# EAGLE schematic PIC32DIP (EAGLE 5.07)
PROJECT: PIC32DIP
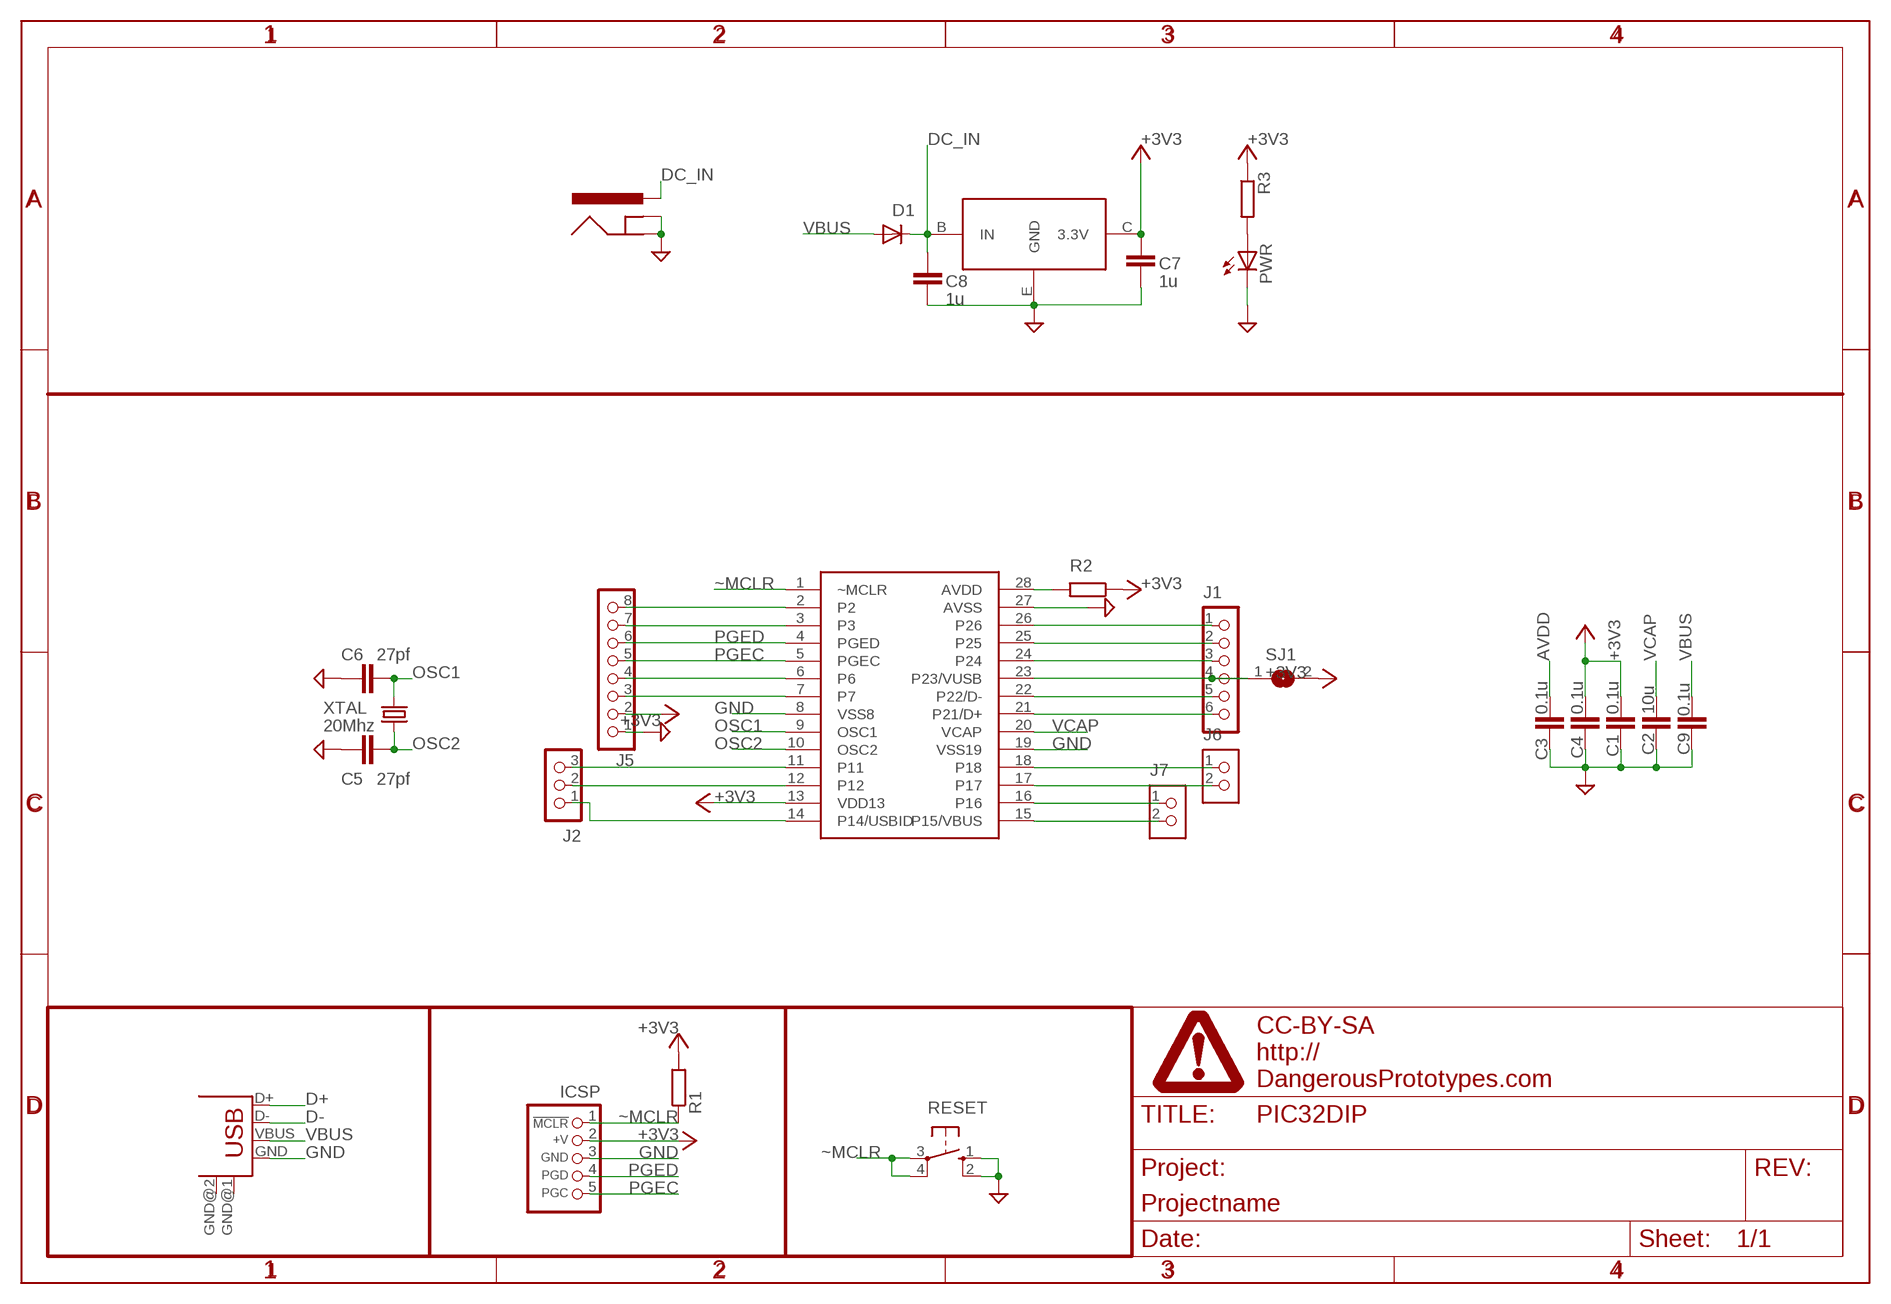
[diagram p0: schematic, sheet 1]

## Parts
C1  0.1u  CAPDECOUPLING  [DEC]
C2  10u  CAPDECOUPLING  [DEC]
C3  0.1u  CAPDECOUPLING  [DEC]
C4  0.1u  CAPDECOUPLING  [DEC]
C5  27pf  CAPDECOUPLING  [DEC]
C6  27pf  CAPDECOUPLING  [DEC]
C7  1u  CAPDECOUPLING  [DEC]
C8  1u  CAPDECOUPLING  [DEC]
C9  0.1u  CAPDECOUPLING  [DEC]
D1  1N4148DO35-7  [DO35-7]
ICSP  HEADER_PRG_PIC_ICSPB  [HEADER_PRG_1X05_ICSP_B]
J1  CON_HEADER_1X06-PTH  [M1X6]
J2  CON_HEADER_1X03-PTH  [M1X3]
J5  CON_HEADER_1X08-PTH  [M1X8]
J6  CON_HEADER_1X02-PTH  [M1X2]
J7  CON_HEADER_1X02-PTH  [M1X2]
PWR  LED-3MM  [LED-3MM]
R1  RESISTORTH  [RTH025W]
R2  RESISTORTH  [RTH025W]
R3  RESISTORTH  [RTH025W]
RESET  10-XX  [B3F-10XX]
SJ1  SJ  [SJ]
U$1  PIC32DIP  [SOCKET-28-3]
U$2  DINA4_L  [DP_LOGO]
U$3  POWER_JACKPTH  [POWER_JACK_PTH]
USB  USB  USB-B-H  [USB-B-H]
VR1  MCP1701-3.3  [TO92-EBC]
XTAL  20Mhz  CRYSTALHC49U70  [HC49U70]

## Nets
+3V3: C1.1 C4.1 C7.1 ICSP.2(+V) J5.2 R1.2 R2.1 R3.1 SJ1.2 U$1.13(VDD13) VR1.C(3.3V)
AVDD: C3.1 R2.2 U$1.28(AVDD)
D+: J1.6 U$1.21(P21/D+) USB.D+
D-: J1.5 U$1.22(P22/D-) USB.D-
DC_IN: C8.1 D1.C U$3.PWR VR1.B(IN)
GND: C1.2 C2.2 C3.2 C4.2 C5.2 C6.2 C7.2 C8.2 C9.2 ICSP.3(GND) J5.1 PWR.K(C) RESET.1(S) RESET.2(S1) U$1.8(VSS8) U$1.19(VSS19) U$1.27(AVSS) U$3.GND U$3.GND@1(GND) USB.GND VR1.E(GND)
N$1: J5.8 U$1.2
N$2: J5.7 U$1.3
N$3: J5.4 U$1.6
N$4: J5.3 U$1.7
N$5: J2.3 U$1.11
N$6: PWR.A R3.2
N$7: J2.2 U$1.12
N$8: J2.1 U$1.14(P14/USBID)
N$9: J7.1 U$1.16
N$10: J6.2 U$1.17
N$11: J6.1 U$1.18
N$12: J1.1 U$1.26
N$13: J1.2 U$1.25
N$14: J1.3 U$1.24
N$15: J1.4 SJ1.1 U$1.23(P23/VUSB)
OSC1: C6.1 U$1.9(OSC1) XTAL.2
OSC2: C5.1 U$1.10(OSC2) XTAL.1
PGEC: ICSP.5(PGC) J5.5 U$1.5(PGEC)
PGED: ICSP.4(PGD) J5.6 U$1.4(PGED)
VBUS: C9.1 D1.A J7.2 U$1.15(P15/VBUS) USB.VBUS
VCAP: C2.1 U$1.20(VCAP)
~MCLR: ICSP.1(/MCLR) R1.1 RESET.3(P) RESET.4(P1) U$1.1(~MCLR)
Unconnected: USB.GND@1(GND) USB.GND@2(GND)

## Library data of the parts
C1-C9 = dp_devices:CAP
D1 = diode:1N4148: DIODE high speed (Philips)
ICSP = DP2:HEADER_PRG_PIC_ICSP: 5-pin PIC In Circuit Serial Programming header
J1 = dp_devices:CON_HEADER_1X06
J2 = dp_devices:CON_HEADER_1X03
J5 = dp_devices:CON_HEADER_1X08
J6 J7 = dp_devices:CON_HEADER_1X02
PWR = dp_devices:LED: Light Emitting Diode
R1-R3 = dp_devices:RESISTOR
RESET = switch-omron:10-XX: OMRON SWITCH; MPN: B3F-1000; OC_FARNELL: 176432; OC_NEWARK: 36M3542
SJ1 = jumper:SJ: SMD solder JUMPER
U$1 = fica2:PIC32DIP
U$2 = DP2:DINA4_L: A4 DP frame Standard Dangerous Prototypes schematic frame. Automagically adds the DP logo and standard texts to the PCB Use the atrribute in the schematic editor to change the fields.; FF1: fulfillment by; FF2: Seeed Studio; FF3: www.seeedstudio.com; LICENSE: CC-BY-SA; PROJECT: Projectname; URL1: http://; URL2: DangerousPrototypes.com
U$3 = SparkFun-3-2-07:POWER_JACK: Power Jack This is the standard 5.5mm barrel jack for power. The PTH is the most common, proven, reliable, footprint. All others are experimental. The Slot footprint only works if the mill layer is transmitted to the PCB fab house so be warned. Spark Fun Electronics SKU : PType-BPJ. Mating wall wart : Tools-PS
USB = con-usb-2:USB: USB Connectors
VR1 = fica2:MCP1701-3.3
XTAL = crystal:CRYSTAL: CRYSTAL